# EAGLE schematic Shield00 (EAGLE 9.4.2)
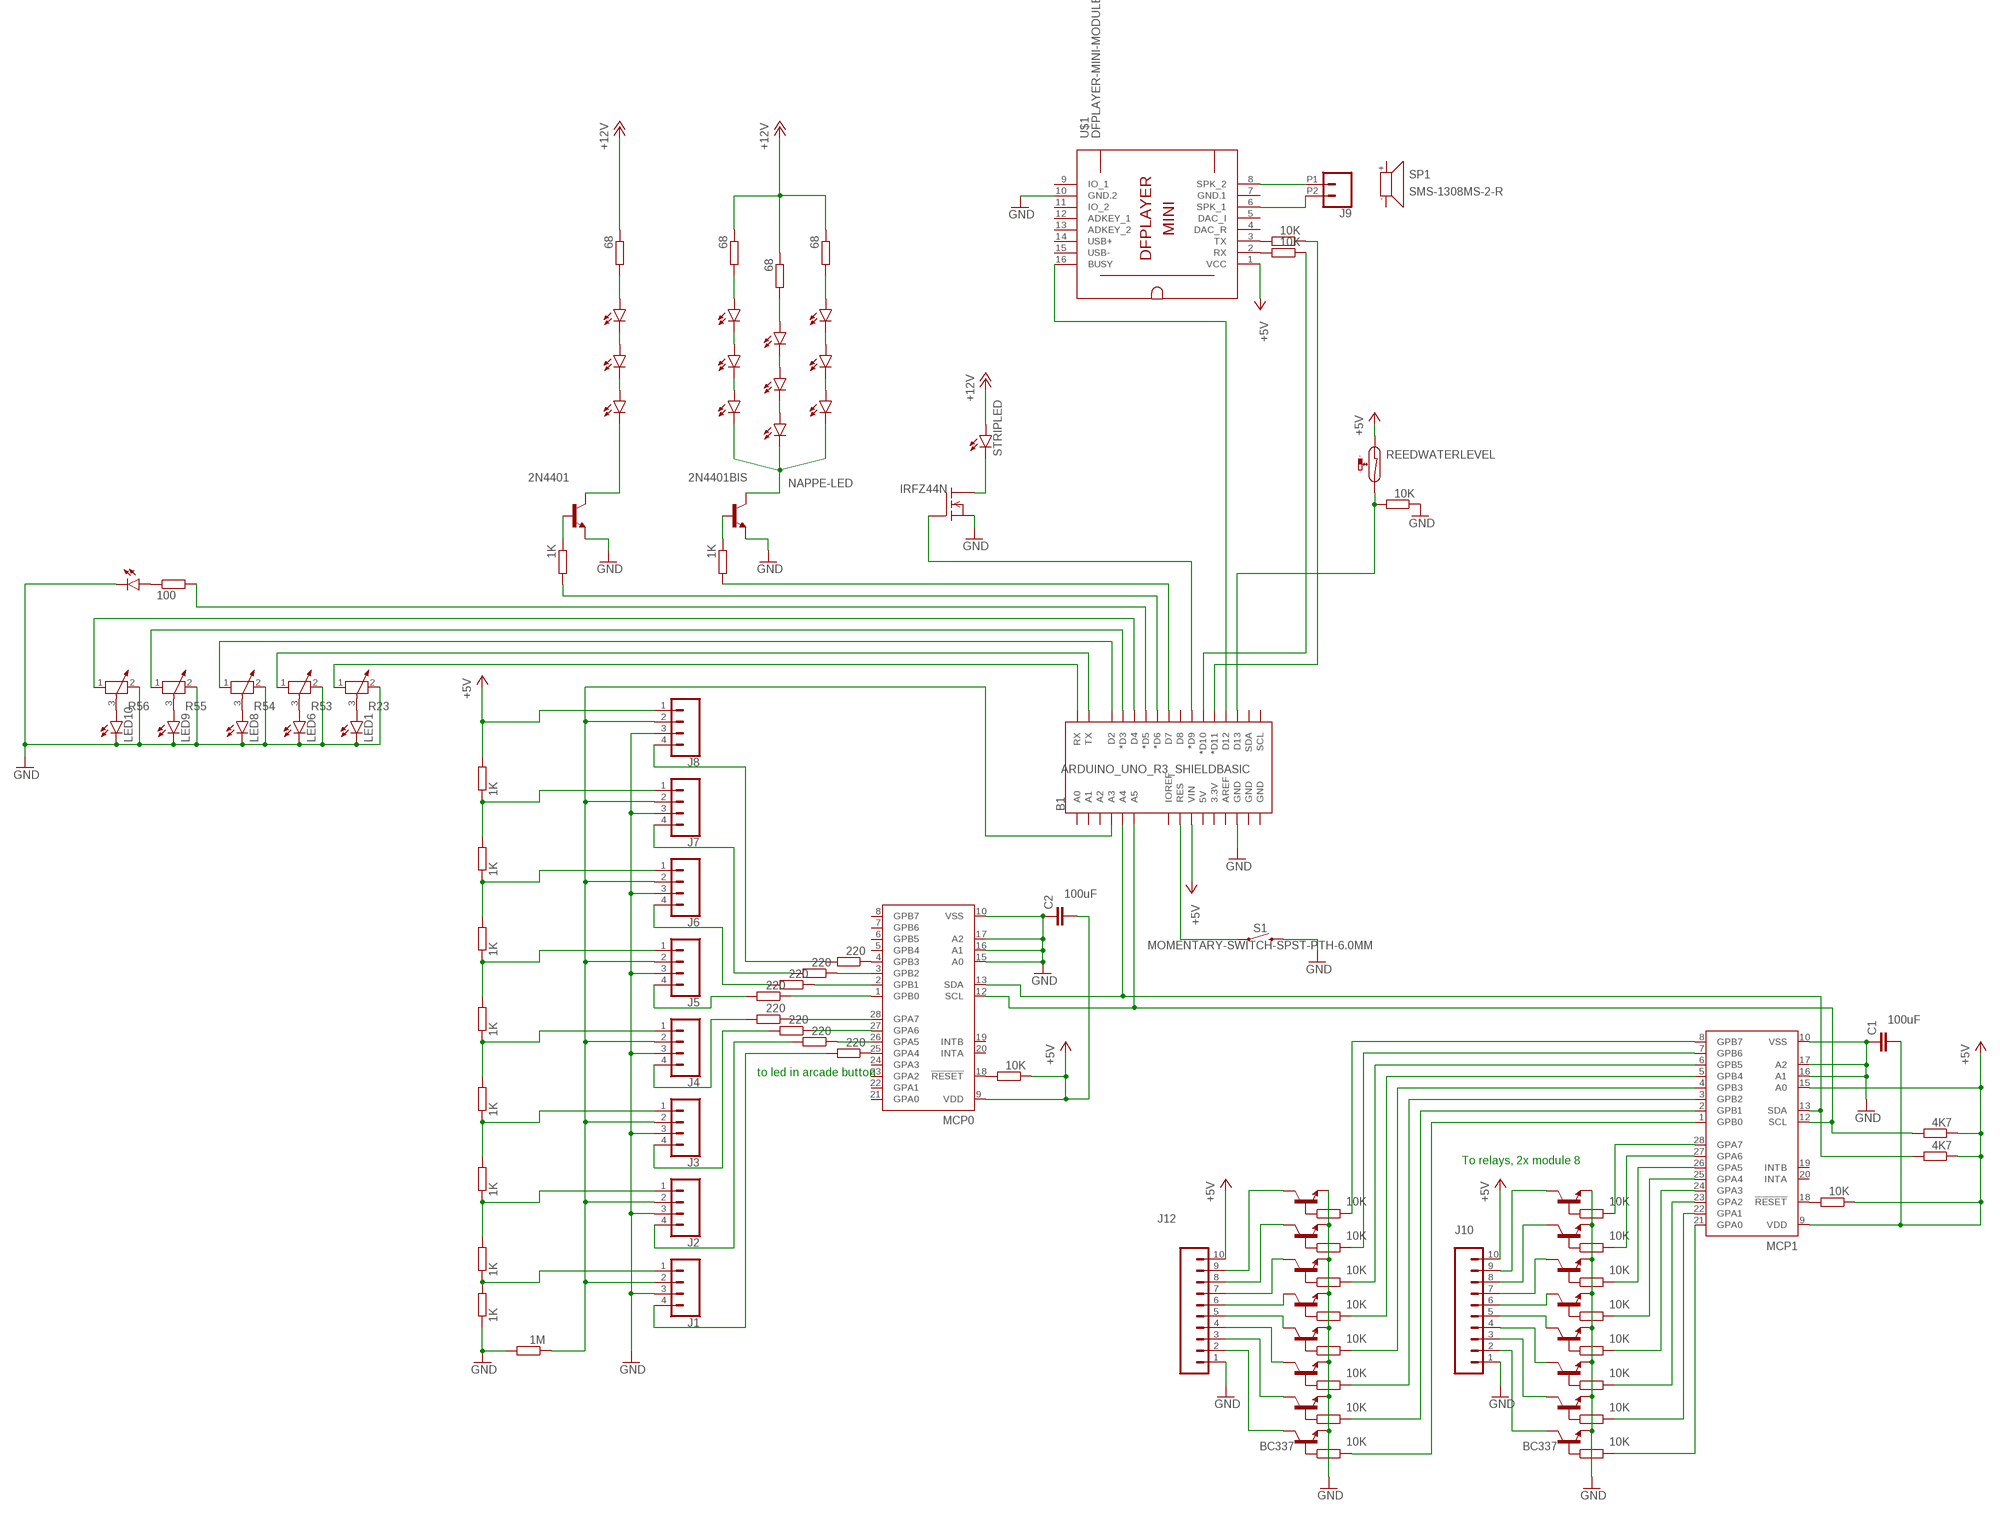
[diagram p0: schematic, sheet 1]

## Parts
2N4401  2N4416  [TO92]
2N4401BIS  2N4416  [TO92]
B1  ARDUINO_UNO_R3_SHIELDBASIC  [UNO_R3_SHIELD]
C1  100uF  C5/3  [C5B3]
C2  100uF  C5/3  [C5B3]
IRFZ44N  IRF840  [TO220]
J1  CONN_04JST-PTH-VERT  [JST-4-PTH-VERT]
J2  CONN_04JST-PTH-VERT  [JST-4-PTH-VERT]
J3  CONN_04JST-PTH-VERT  [JST-4-PTH-VERT]
J4  CONN_04JST-PTH-VERT  [JST-4-PTH-VERT]
J5  CONN_04JST-PTH-VERT  [JST-4-PTH-VERT]
J6  CONN_04JST-PTH-VERT  [JST-4-PTH-VERT]
J7  CONN_04JST-PTH-VERT  [JST-4-PTH-VERT]
J8  CONN_04JST-PTH-VERT  [JST-4-PTH-VERT]
J9  CONN_022.54MM_SCREWTERM  [1X02_2.54_SCREWTERM]
J10  CONN_10"  [1X10]
J12  CONN_10"  [1X10]
LED1  LED5MM  [LED5MM]
LED6  LED5MM  [LED5MM]
LED8  LED5MM  [LED5MM]
LED9  LED5MM  [LED5MM]
LED10  LED5MM  [LED5MM]
MCP0  MCP23017SO  [SO28W]
MCP1  MCP23017SO  [SO28W]
NAPPE-LED  LED5MM  [LED5MM]
NAPPE-LED1  LED5MM  [LED5MM]
NAPPE-LED2  LED5MM  [LED5MM]
NAPPE-LED3  LED5MM  [LED5MM]
NAPPE-LED4  LED5MM  [LED5MM]
NAPPE-LED5  LED5MM  [LED5MM]
NAPPE-LED6  LED5MM  [LED5MM]
NAPPE-LED7  LED5MM  [LED5MM]
NAPPE-LED8  LED5MM  [LED5MM]
NAPPE-LED9  LED5MM  [LED5MM]
NAPPE-LED10  LED5MM  [LED5MM]
NAPPE-LED11  LED5MM  [LED5MM]
NAPPE-LED12  LED5MM  [LED5MM]
R1  1K  R-EU_R0805  [R0805]
R2  1M  R-EU_R0805  [R0805]
R3  1K  R-EU_R0805  [R0805]
R4  1K  R-EU_R0805  [R0805]
R5  1K  R-EU_R0805  [R0805]
R6  1K  R-EU_R0805  [R0805]
R7  1K  R-EU_R0805  [R0805]
R8  1K  R-EU_R0805  [R0805]
R9  1K  R-EU_R0805  [R0805]
R10  10K  R-EU_R0805  [R0805]
R11  220  R-EU_R0805  [R0805]
R12  220  R-EU_R0805  [R0805]
R13  220  R-EU_R0805  [R0805]
R14  220  R-EU_R0805  [R0805]
R15  220  R-EU_R0805  [R0805]
R16  220  R-EU_R0805  [R0805]
R17  220  R-EU_R0805  [R0805]
R18  220  R-EU_R0805  [R0805]
R19  10K  R-EU_R0805  [R0805]
R20  10K  R-EU_R0805  [R0805]
R21  10K  R-EU_R0805  [R0805]
R22  10K  R-EU_R0805  [R0805]
R23  POTENTIOMETER_PT-10  [PT-10]
R24  4K7  R-EU_R0805  [R0805]
R25  4K7  R-EU_R0805  [R0805]
R26  1K  R-EU_R0805  [R0805]
R27  10K  R-EU_R0805  [R0805]
R28  10K  R-EU_R0805  [R0805]
R29  10K  R-EU_R0805  [R0805]
R30  10K  R-EU_R0805  [R0805]
R31  10K  R-EU_R0805  [R0805]
R32  10K  R-EU_R0805  [R0805]
R33  10K  R-EU_R0805  [R0805]
R34  10K  R-EU_R0805  [R0805]
R35  10K  R-EU_R0805  [R0805]
R36  10K  R-EU_R0805  [R0805]
R37  10K  R-EU_R0805  [R0805]
R38  10K  R-EU_R0805  [R0805]
R39  10K  R-EU_R0805  [R0805]
R40  10K  R-EU_R0805  [R0805]
R41  10K  R-EU_R0805  [R0805]
R42  10K  R-EU_R0805  [R0805]
R43  1K  R-EU_R0805  [R0805]
R47  68  R-EU_R0805  [R0805]
R49  68  R-EU_R0805  [R0805]
R50  68  R-EU_R0805  [R0805]
R51  68  R-EU_R0805  [R0805]
R52  100  R-EU_R0805  [R0805]
R53  POTENTIOMETER_PT-10  [PT-10]
R54  POTENTIOMETER_PT-10  [PT-10]
R55  POTENTIOMETER_PT-10  [PT-10]
R56  POTENTIOMETER_PT-10  [PT-10]
REEDWATERLEVEL  REED-SWITCH-MK6-5-B  [MK6-5]
S1  MOMENTARY-SWITCH-SPST-PTH-6.0MM  [TACTILE_SWITCH_PTH_6.0MM]
SP1  SMS-1308MS-2-R  [SMS-1308MS-2-R]
STRIPLED  LED5MM  [LED5MM]
T1  BC337  [TO92]
T2  BC337  [TO92]
T3  BC337  [TO92]
T4  BC337  [TO92]
T5  BC337  [TO92]
T6  BC337  [TO92]
T7  BC337  [TO92]
T8  BC337  [TO92]
T9  BC337  [TO92]
T10  BC337  [TO92]
T11  BC337  [TO92]
T12  BC337  [TO92]
T13  BC337  [TO92]
T14  BC337  [TO92]
T15  BC337  [TO92]
T16  BC337  [TO92]
U$1  DFPLAYER-MINI-MODULE  [DFPLAYER-MINI-MODULE]

## Nets
+5V: B1.VIN C1.2 C2.2 J8.1 J10.10 J12.10 MCP0.9(VDD) MCP1.9(VDD) MCP1.15(A0) R9.2 R20.1 R22.1 R24.1 R25.1 REEDWATERLEVEL.1 U$1.1(VCC)
+12V: R47.1 R49.1 R50.1 R51.1 STRIPLED.A
GND: 2N4401.3(E) 2N4401BIS.3(E) B1.GND@2(GND) C1.1 C2.1 IRFZ44N.3(S) J1.3 J2.3 J3.3 J4.3 J5.3 J6.3 J7.3 J8.3 J10.1 J12.1 LED1.K(C) LED6.K(C) LED8.K(C) LED9.K(C) LED10.K(C) MCP0.10(VSS) MCP0.15(A0) MCP0.16(A1) MCP0.17(A2) MCP1.10(VSS) MCP1.16(A1) MCP1.17(A2) NAPPE-LED12.K(C) R1.1 R2.2 R21.1 R23.2 R53.2 R54.2 R55.2 R56.2 S1.3 T1.1(E) T2.1(E) T3.1(E) T4.1(E) T5.1(E) T6.1(E) T7.1(E) T8.1(E) T9.1(E) T10.1(E) T11.1(E) T12.1(E) T13.1(E) T14.1(E) T15.1(E) T16.1(E) U$1.10(GND.2)
N$1: J1.1 R1.2 R3.1
N$2: B1.A3 J1.2 J2.2 J3.2 J4.2 J5.2 J6.2 J7.2 J8.2 R2.1
N$3: J2.1 R3.2 R4.1
N$4: MCP0.25(GPA4) R11.1
N$5: J3.1 R4.2 R5.1
N$6: J1.4 R11.2
N$7: J4.1 R5.2 R6.1
N$8: J2.4 R12.2
N$9: J5.1 R6.2 R7.1
N$10: MCP0.3(GPB2) R17.1
N$11: J6.1 R7.2 R8.1
N$12: MCP0.26(GPA5) R12.1
N$13: J7.1 R8.2 R9.1
N$14: MCP0.27(GPA6) R13.1
N$15: MCP0.28(GPA7) R14.1
N$16: MCP0.1(GPB0) R15.1
N$17: MCP0.2(GPB1) R16.1
N$18: B1.A4 MCP0.13(SDA) MCP1.13(SDA) R25.2
N$19: J8.4 R18.2
N$20: MCP0.4(GPB3) R18.1
N$21: J3.4 R13.2
N$22: J4.4 R14.2
N$23: J5.4 R15.2
N$24: J6.4 R16.2
N$25: J7.4 R17.2
N$26: J9.P1 U$1.8(SPK_2)
N$27: J9.P2 U$1.6(SPK_1)
N$28: R10.2 U$1.3(TX)
N$29: B1.A5 MCP0.12(SCL) MCP1.12(SCL) R24.2
N$30: MCP0.18(!RESET) R20.2
N$31: R19.2 U$1.2(RX)
N$32: B1.D10(*D10) R19.1
N$33: B1.D11(*D11) R10.1
N$34: B1.D12 U$1.16(BUSY)
N$35: MCP1.18(!RESET) R22.2
N$36: B1.D13 R21.2 REEDWATERLEVEL.2
N$37: MCP1.5(GPB4) R39.2
N$38: MCP1.4(GPB3) R38.2
N$39: MCP1.3(GPB2) R37.2
N$40: MCP1.2(GPB1) R36.2
N$41: MCP1.1(GPB0) R35.2
N$42: R32.1 T6.2(B)
N$43: R35.1 T9.2(B)
N$44: R27.1 T1.2(B)
N$45: R28.1 T2.2(B)
N$46: R30.1 T4.2(B)
N$47: R29.1 T3.2(B)
N$48: R31.1 T5.2(B)
N$49: R33.1 T7.2(B)
N$50: MCP1.6(GPB5) R40.2
N$51: MCP1.7(GPB6) R41.2
N$52: MCP1.8(GPB7) R42.2
N$53: R34.1 T8.2(B)
N$54: R36.1 T10.2(B)
N$55: LED1.A R23.3
N$56: R37.1 T11.2(B)
N$57: R38.1 T12.2(B)
N$58: R39.1 T13.2(B)
N$59: R40.1 T14.2(B)
N$60: R41.1 T15.2(B)
N$61: R42.1 T16.2(B)
N$62: MCP1.28(GPA7) R34.2
N$63: MCP1.27(GPA6) R33.2
N$64: MCP1.26(GPA5) R32.2
N$65: MCP1.25(GPA4) R31.2
N$66: MCP1.24(GPA3) R30.2
N$67: MCP1.23(GPA2) R29.2
N$68: MCP1.22(GPA1) R28.2
N$69: MCP1.21(GPA0) R27.2
N$70: J10.5 T4.3(C)
N$71: J10.6 T5.3(C)
N$72: J10.7 T6.3(C)
N$73: J10.8 T7.3(C)
N$74: J10.9 T8.3(C)
N$75: J10.4 T3.3(C)
N$76: J10.3 T2.3(C)
N$77: J10.2 T1.3(C)
N$78: J12.6 T13.3(C)
N$79: J12.5 T12.3(C)
N$80: J12.4 T11.3(C)
N$81: J12.7 T14.3(C)
N$82: J12.3 T10.3(C)
N$83: J12.2 T9.3(C)
N$84: J12.8 T15.3(C)
N$85: J12.9 T16.3(C)
N$86: B1.RX R23.1
N$87: 2N4401.2(B) R26.1
N$88: 2N4401BIS.2(B) R43.1
N$89: B1.RES S1.1
N$97: B1.D9(*D9) IRFZ44N.1(G)
N$99: 2N4401BIS.1(C) NAPPE-LED3.K(C) NAPPE-LED6.K(C) NAPPE-LED.K(C)
N$100: IRFZ44N.2(D) STRIPLED.K(C)
N$101: B1.D7 R43.2
N$102: NAPPE-LED1.K(C) NAPPE-LED.A
N$104: NAPPE-LED1.A NAPPE-LED2.K(C)
N$105: NAPPE-LED2.A R47.2
N$106: NAPPE-LED9.A NAPPE-LED10.K(C)
N$107: NAPPE-LED3.A NAPPE-LED4.K(C)
N$108: NAPPE-LED4.A NAPPE-LED5.K(C)
N$109: NAPPE-LED5.A R49.2
N$110: NAPPE-LED10.A NAPPE-LED11.K(C)
N$111: NAPPE-LED6.A NAPPE-LED7.K(C)
N$112: NAPPE-LED7.A NAPPE-LED8.K(C)
N$113: NAPPE-LED8.A R50.2
N$114: NAPPE-LED11.A R51.2
N$115: 2N4401.1(C) NAPPE-LED9.K(C)
N$116: B1.D6(*D6) R26.2
N$117: B1.D5(*D5) R52.2
N$118: NAPPE-LED12.A R52.1
N$121: B1.TX R53.1
N$122: LED6.A R53.3
N$124: LED8.A R54.3
N$125: B1.D2 R54.1
N$127: LED9.A R55.3
N$128: B1.D3(*D3) R55.1
N$129: LED10.A R56.3
N$130: B1.D4 R56.1
Unconnected: B1.3.3V B1.5V B1.A0 B1.A1 B1.A2 B1.AREF B1.D8 B1.GND@0(GND) B1.GND@1(GND) B1.IOREF B1.SCL B1.SDA MCP0.5(GPB4) MCP0.6(GPB5) MCP0.7(GPB6) MCP0.8(GPB7) MCP0.19(INTB) MCP0.20(INTA) MCP0.21(GPA0) MCP0.22(GPA1) MCP0.23(GPA2) MCP0.24(GPA3) MCP1.19(INTB) MCP1.20(INTA) SP1.+ SP1.- U$1.4(DAC_R) U$1.5(DAC_I) U$1.9(IO_1) U$1.11(IO_2) U$1.12(ADKEY_1) U$1.13(ADKEY_2) U$1.14(USB+) U$1.15(USB-)

## Notes on the sheet
- to led in arcade button
- To relays, 2x module 8

## Power pins joined to a net without a drawn wire
GND.1: U$1.7(GND.1)

## Library data of the parts
2N4401 2N4401BIS = transistor-neu-to92:2N4416: NPN TRANSISTOR
B1 = SparkFun-Boards:ARDUINO_UNO_R3_SHIELD: Arduino R3 Shield Footprint Shield form compatible with the Arduino Uno R3. SparkFun Products: MG2639 Cellular Shield <https://www.sparkfun.com/products/13120> MIDI Shield <https://www.sparkfun.com/products/12898> R3 Stackable Headers Kit <https://www.sparkfun.com/products/11417>
C1 C2 = capacitor-wima:C: CAPACITOR naming: grid - package width
IRFZ44N = transistor-fet:IRF840: N-Channel Enhancement MOSFET (HEXFET); 500V; 8A; 0,85Ohm
J1-J8 = SparkFun-Connectors:CONN_04: Multi connection point. Often used as Generic Header-pin footprint for 0.1 inch spaced/style header connections On any of the 0.1 inch spaced packages, you can populate with these: Break Away Headers - Straight <https://www.sparkfun.com/products/116> (PRT-00116) Break Away Male Headers - Right Angle <https://www.sparkfun.com/products/553> (PRT-00553) Female Headers <https://www.sparkfun.com/products/115> (PRT-00115) Break Away Headers - Machine Pin <https://www.sparkfun.com/products/117> (PRT-00117) Break Away Female Headers - Swiss Machine Pin <https://www.sparkfun.com/products/743> (PRT-00743) For SCREWTERMINALS and SPRING TERMINALS visit here: Screw Terimnals on SparkFun.com <https://www.sparkfun.com/search/results?term=Screw+Terminals> (5mm/3.5mm/2.54mm spacing) This device is also useful as a general connection point to wire up your design to another part of your project. Our various solder wires solder well into these plated through hole pads. Hook-Up Wire - Assortment (Stranded, 22 AWG) <https://www.sparkfun.com/products/11375> (PRT-11375) Hook-Up Wire - Assortment (Solid Core, 22 AWG) <https://www.sparkfun.com/products/11367> (PRT-11367) View the entire wire category on our website here <https://www.sparkfun.com/categories/141> Special notes: Molex polarized connector foot print use with SKU : PRT-08231 with associated crimp pins and housings. 1MM SMD Version SKU: PRT-10208; PROD_ID: CONN-13251
J9 = SparkFun-Connectors:CONN_02: Multi connection point. Often used as Generic Header-pin footprint for 0.1 inch spaced/style header connections On any of the 0.1 inch spaced packages, you can populate with these: Break Away Headers - Straight <https://www.sparkfun.com/products/116> (PRT-00116) Break Away Male Headers - Right Angle <https://www.sparkfun.com/products/553> (PRT-00553) Female Headers <https://www.sparkfun.com/products/115> (PRT-00115) Break Away Headers - Machine Pin <https://www.sparkfun.com/products/117> (PRT-00117) Break Away Female Headers - Swiss Machine Pin <https://www.sparkfun.com/products/743> (PRT-00743) For SCREWTERMINALS and SPRING TERMINALS visit here: Screw Terimnals on SparkFun.com <https://www.sparkfun.com/search/results?term=Screw+Terminals> (5mm/3.5mm/2.54mm spacing) This device is also useful as a general connection point to wire up your design to another part of your project. Our various solder wires solder well into these plated through hole pads. Hook-Up Wire - Assortment (Stranded, 22 AWG) <https://www.sparkfun.com/products/11375> (PRT-11375) Hook-Up Wire - Assortment (Solid Core, 22 AWG) <https://www.sparkfun.com/products/11367> (PRT-11367) View the entire wire category on our website here <https://www.sparkfun.com/categories/141> Special notes: Molex polarized connector foot print use with: PRT-08233 with associated crimp pins and housings. 2.54_SCREWTERM for use with PRT-10571. 3.5mm Screw Terminal footprints for PRT-08084 5mm Screw Terminal footprints for use with PRT-08432
J10 J12 = SparkFun-Connectors:CONN_10: Multi connection point. Often used as Generic Header-pin footprint for 0.1 inch spaced/style header connections On any of the 0.1 inch spaced packages, you can populate with these: Break Away Headers - Straight <https://www.sparkfun.com/products/116> (PRT-00116) Break Away Male Headers - Right Angle <https://www.sparkfun.com/products/553> (PRT-00553) Female Headers <https://www.sparkfun.com/products/115> (PRT-00115) Break Away Headers - Machine Pin <https://www.sparkfun.com/products/117> (PRT-00117) Break Away Female Headers - Swiss Machine Pin <https://www.sparkfun.com/products/743> (PRT-00743) Arduino Stackable Header - 10 Pin <https://www.sparkfun.com/products/11376> (PRT-11376) For SCREWTERMINALS and SPRING TERMINALS visit here: Screw Terimnals on SparkFun.com <https://www.sparkfun.com/search/results?term=Screw+Terminals> (5mm/3.5mm/2.54mm spacing) This device is also useful as a general connection point to wire up your design to another part of your project. Our various solder wires solder well into these plated through hole pads. Hook-Up Wire - Assortment (Stranded, 22 AWG) <https://www.sparkfun.com/products/11375> (PRT-11375) Hook-Up Wire - Assortment (Solid Core, 22 AWG) <https://www.sparkfun.com/products/11367> (PRT-11367) View the entire wire category on our website here <https://www.sparkfun.com/categories/141> Special notes: Molex polarized connector foot print use with SKU : PRT-08231 with associated crimp pins and housings. 1MM SMD Version SKU: PRT-10208 NOTES ON THE VARIANTS LOCK and LOCK_LONGPADS... This footprint was designed to help hold the alignment of a through-hole component (i.e. 6-pin header) while soldering it into place. You may notice that each hole has been shifted either up or down by 0.005 of an inch from it's more standard position (which is a perfectly straight line). This slight alteration caused the pins (the squares in the middle) to touch the edges of the holes. Because they are alternating, it causes a "brace" to hold the component in place. 0.005 has proven to be the perfect amount of "off-center" position when using our standard breakaway headers. Although looks a little odd when you look at the bare footprint, once you have a header in there, the alteration is very hard to notice. Also,if you push a header all the way into place, it is covered up entirely on the bottom side.; PROD_ID: CONN-11563
LED1 LED6 LED8-LED10 NAPPE-LED NAPPE-LED1-NAPPE-LED12 STRIPLED = led:LED: LED OSRAM: - CHIPLED LG R971, LG N971, LY N971, LG Q971, LY Q971, LO R971, LY R971 LH N974, LH R974 LS Q976, LO Q976, LY Q976 LO Q996 - Hyper CHIPLED LW Q18S LB Q993, LB Q99A, LB R99A - SideLED LS A670, LO A670, LY A670, LG A670, LP A670 LB A673, LV A673, LT A673, LW A673 LH A674 LY A675 LS A676, LA A676, LO A676, LY A676, LW A676 LS A679, LY A679, LG A679 - Hyper Micro SIDELED® LS Y876, LA Y876, LO Y876, LY Y876 LT Y87S - SmartLED LW L88C, LW L88S LB L89C, LB L89S, LG L890 LS L89K, LO L89K, LY L89K LS L896, LA L896, LO L896, LY L896 - TOPLED LS T670, LO T670, LY T670, LG T670, LP T670 LSG T670, LSP T670, LSY T670, LOP T670, LYG T670 LG T671, LOG T671, LSG T671 LB T673, LV T673, LT T673, LW T673 LH T674 LS T676, LA T676, LO T676, LY T676, LB T676, LH T676, LSB T676, LW T676 LB T67C, LV T67C, LT T67C, LS T67K, LO T67K, LY T67K, LW E67C LS E67B, LA E67B, LO E67B, LY E67B, LB E67C, LV E67C, LT E67C LW T67C LS T679, LY T679, LG T679 LS T770, LO T770, LY T770, LG T770, LP T770 LB T773, LV T773, LT T773, LW T773 LH T774 LS E675, LA E675, LY E675, LS T675 LS T776, LA T776, LO T776, LY T776, LB T776 LHGB T686 LT T68C, LB T68C - Hyper Mini TOPLED® LB M676 - Mini TOPLED Santana® LG M470 LS M47K, LO M47K, LY M47K Source: http://www.osram.convergy.de LUXEON: - LUMILED® LXK2-PW12-R00, LXK2-PW12-S00, LXK2-PW14-U00, LXK2-PW14-V00 LXK2-PM12-R00, LXK2-PM12-S00, LXK2-PM14-U00 LXK2-PE12-Q00, LXK2-PE12-R00, LXK2-PE12-S00, LXK2-PE14-T00, LXK2-PE14-U00 LXK2-PB12-K00, LXK2-PB12-L00, LXK2-PB12-M00, LXK2-PB14-N00, LXK2-PB14-P00, LXK2-PB14-Q00 LXK2-PR12-L00, LXK2-PR12-M00, LXK2-PR14-Q00, LXK2-PR14-R00 LXK2-PD12-Q00, LXK2-PD12-R00, LXK2-PD12-S00 LXK2-PH12-R00, LXK2-PH12-S00 LXK2-PL12-P00, LXK2-PL12-Q00, LXK2-PL12-R00 Source: www.luxeon.com KINGBRIGHT: KA-3528ASYC Source: www.kingbright.com
MCP0 MCP1 = microchip:MCP23017: http://ww1.microchip.com/downloads/en/DeviceDoc/21952a.pdf Source: http://ww1.microchip.com/downloads/en/DeviceDoc/21952a.pdf; MF: MICROCHIP; MPN: MCP23017-E/SO; OC_FARNELL: 1332087; OC_NEWARK: 31K2958
R1-R22 R24-R43 R47 R49-R52 = rcl:R-EU_: RESISTOR, European symbol; SPICEPREFIX: R
R23 R53-R56 = rcl:POTENTIOMETER_: Potentiometer; SPICEMODEL: POT; SPICEPREFIX: X
REEDWATERLEVEL = switch-reed:REED-SWITCH-: Reed Sensor; MF: MEDER; MPN: MK6-5-B; OC_FARNELL: 1079479
S1 = SparkFun-Switches:MOMENTARY-SWITCH-SPST: Momentary Switch (Pushbutton) - SPST Normally-open (NO) SPST momentary switches (buttons, pushbuttons). Variants PTH-12MM - 12mm square, through-hole Momentary Pushbutton Switch - 12mm Square <https://www.sparkfun.com/products/9190> (COM-09190) PTH-6.0MM, PTH-6.0MM-KIT - 6.0mm square, through-hole Mini Pushbutton Switch <https://www.sparkfun.com/products/97> (COM-00097) KIT package intended for soldering kit's - only one side of pads' copper is exposed. PTH-RIGHT-ANGLE-KIT - Right-angle, through-hole Right Angle Tactile Button <https://www.sparkfun.com/products/10791> - Used on SparkFun BigTime Watch Kit <https://www.sparkfun.com/products/11734> SMD-12MM - 12mm square, surface-mount Tactile Button - SMD (12mm) <https://www.sparkfun.com/products/12993> (COM-12993) Used on SparkFun PicoBoard <https://www.sparkfun.com/products/11888> SMD-4.5MM - 4.5mm Square Trackball Switch Used on SparkFun Blackberry Trackballer Breakout <https://www.sparkfun.com/products/13169> SMD-4.6MMX2.8MM - 4.60mm x 2.80mm, surface mount Used on SparkFun SAMD21 Mini Breakout <https://www.sparkfun.com/products/13664> SMD-5.2MM, SMD-5.2-REDUNDANT - 5.2mm square, surface-mount Mini Pushbutton Switch - SMD <https://www.sparkfun.com/products/8720> (COM-08720) Used on Arduino Pro Mini <https://www.sparkfun.com/products/11114> REDUNDANT package connects both switch circuits together SMD-6.0X3.5MM - 6.0 x 3.5mm, surface mount Momentary Reset Switch SMD <https://www.sparkfun.com/products/8229> (COM-08229) SMD-6.2MM-TALL - 6.2mm square, surface mount Tactile Button - SMD (6mm) <https://www.sparkfun.com/products/12992> Used on SparkFun Digital Sandbox <https://www.sparkfun.com/products/12651> SMD-RIGHT-ANGLE - Right-angle, surface mount Used on SparkFun Block for Intel® Edison - Arduino <https://www.sparkfun.com/products/13036>; PROD_ID: SWCH-08441; SF_SKU: COM-00097
SP1 = speaker:SMS-1308MS-2-R: Speaker 13 x 13mm, 8 Ohm, 0.7W Source: pui audio inc. SMS-1308MS-2-R.pdf
T1-T16 = transistor:BC337: NPN TRANSISTOR
U$1 = diy-modules:DFPLAYER-MINI-MODULE: DFPlayer Mini - MP3 player module based on YX5200 chip More details available here: https://www.dfrobot.com/wiki/index.php/DFPlayer_Mini_SKU:DFR0299 Click here to find device on ebay.com <http://www.ebay.com/sch/dfplayer+mini>